# EAGLE design Piano DIY Project Yay (EAGLE 9.2.2)
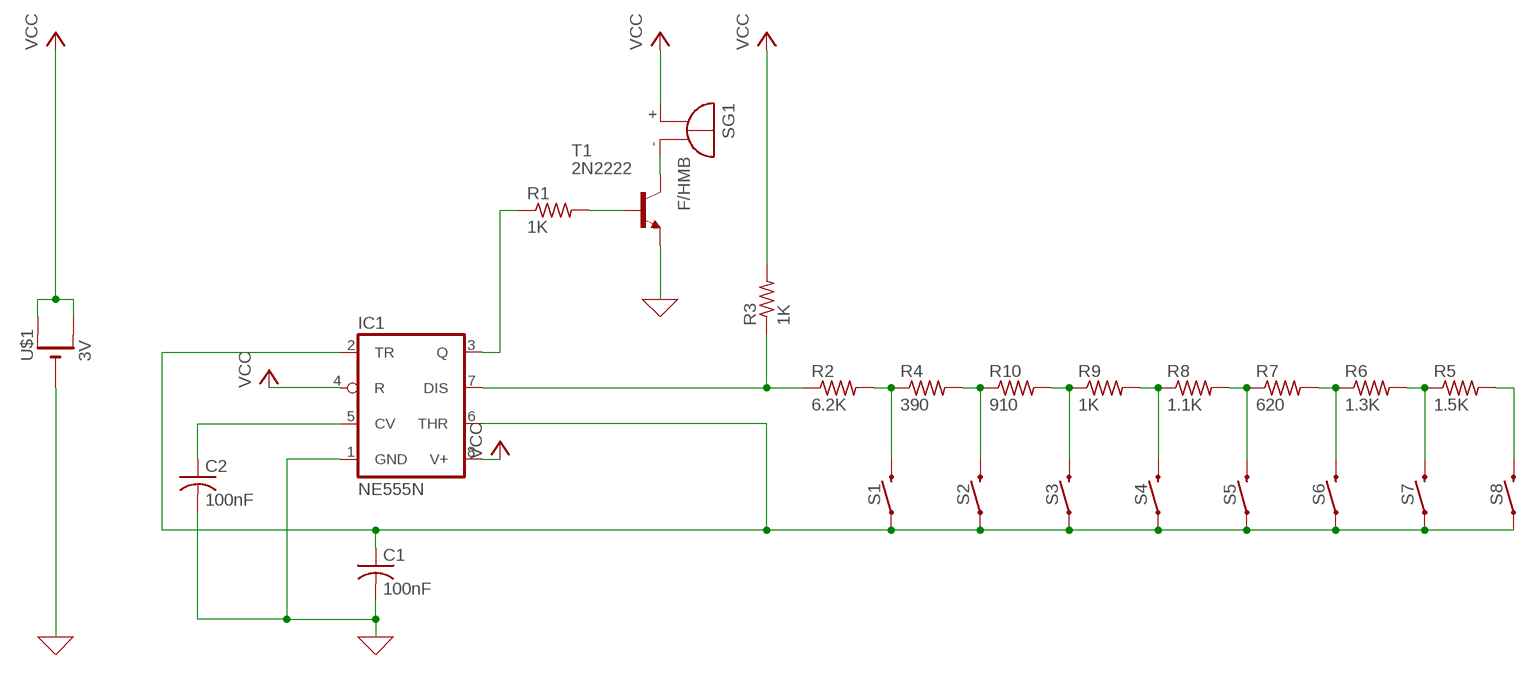
[diagram p0: schematic, sheet 1]

## Parts
C1  100nF  C-US025-025X050  [C025-025X050]
C2  100nF  C-US025-025X050  [C025-025X050]
IC1  NE555N  [DIL08]
R1  1K  R-US_0207/10  [0207/10]
R2  6.2K  R-US_0207/10  [0207/10]
R3  1K  R-US_0207/10  [0207/10]
R4  390  R-US_0207/10  [0207/10]
R5  1.5K  R-US_0207/10  [0207/10]
R6  1.3K  R-US_0207/10  [0207/10]
R7  620  R-US_0207/10  [0207/10]
R8  1.1K  R-US_0207/10  [0207/10]
R9  1K  R-US_0207/10  [0207/10]
R10  910  R-US_0207/10  [0207/10]
S1  MOMENTARY-SWITCH-SPST-PTH-6.0MM  [TACTILE_SWITCH_PTH_6.0MM]
S2  MOMENTARY-SWITCH-SPST-PTH-6.0MM  [TACTILE_SWITCH_PTH_6.0MM]
S3  MOMENTARY-SWITCH-SPST-PTH-6.0MM  [TACTILE_SWITCH_PTH_6.0MM]
S4  MOMENTARY-SWITCH-SPST-PTH-6.0MM  [TACTILE_SWITCH_PTH_6.0MM]
S5  MOMENTARY-SWITCH-SPST-PTH-6.0MM  [TACTILE_SWITCH_PTH_6.0MM]
S6  MOMENTARY-SWITCH-SPST-PTH-6.0MM  [TACTILE_SWITCH_PTH_6.0MM]
S7  MOMENTARY-SWITCH-SPST-PTH-6.0MM  [TACTILE_SWITCH_PTH_6.0MM]
S8  MOMENTARY-SWITCH-SPST-PTH-6.0MM  [TACTILE_SWITCH_PTH_6.0MM]
SG1  F/HMB  [F/HMB]
T1  2N2222  -NPN-TO92  [TO92]
U$1  3V  CR1220THM  [CR1220-THM]

## Nets
0: C1.2 C2.2 IC1.1(GND) T1.1(E) U$1.- ; supply symbol labelled GND
N$1: IC1.3(Q) R1.1
N$2: R1.2 T1.2(B)
N$3: SG1.- T1.3(C)
N$4: IC1.7(DIS) R2.1 R3.1
N$5: R2.2 R4.1 S1.3
N$6: R4.2 R10.1 S2.3
N$7: R9.1 R10.2 S3.3
N$8: R8.1 R9.2 S4.3
N$9: R7.1 R8.2 S5.3
N$10: R6.1 R7.2 S6.3
N$11: R5.1 R6.2 S7.3
N$12: R5.2 S8.3
N$13: C1.1 IC1.2(TR) IC1.6(THR) S1.1 S2.1 S3.1 S4.1 S5.1 S6.1 S7.1 S8.1
N$14: C2.1 IC1.5(CV)
VCC: IC1.4(R) IC1.8(V+) R3.2 SG1.+ U$1.+1(+) U$1.+2(+1)

## Library data of the parts
C1 C2 = rcl:C-US: CAPACITOR, American symbol; SPICEPREFIX: C
IC1 = linear:*555: TIMER
R1-R10 = rcl:R-US_: RESISTOR, American symbol; SPICEPREFIX: R
S1-S8 = SparkFun-Switches:MOMENTARY-SWITCH-SPST: Momentary Switch (Pushbutton) - SPST Normally-open (NO) SPST momentary switches (buttons, pushbuttons). Variants PTH-12MM - 12mm square, through-hole Momentary Pushbutton Switch - 12mm Square <https://www.sparkfun.com/products/9190> (COM-09190) PTH-6.0MM, PTH-6.0MM-KIT - 6.0mm square, through-hole Mini Pushbutton Switch <https://www.sparkfun.com/products/97> (COM-00097) KIT package intended for soldering kit's - only one side of pads' copper is exposed. PTH-RIGHT-ANGLE-KIT - Right-angle, through-hole Right Angle Tactile Button <https://www.sparkfun.com/products/10791> - Used on SparkFun BigTime Watch Kit <https://www.sparkfun.com/products/11734> SMD-12MM - 12mm square, surface-mount Tactile Button - SMD (12mm) <https://www.sparkfun.com/products/12993> (COM-12993) Used on SparkFun PicoBoard <https://www.sparkfun.com/products/11888> SMD-4.5MM - 4.5mm Square Trackball Switch Used on SparkFun Blackberry Trackballer Breakout <https://www.sparkfun.com/products/13169> SMD-4.6MMX2.8MM - 4.60mm x 2.80mm, surface mount Used on SparkFun SAMD21 Mini Breakout <https://www.sparkfun.com/products/13664> SMD-5.2MM, SMD-5.2-REDUNDANT - 5.2mm square, surface-mount Mini Pushbutton Switch - SMD <https://www.sparkfun.com/products/8720> (COM-08720) Used on Arduino Pro Mini <https://www.sparkfun.com/products/11114> REDUNDANT package connects both switch circuits together SMD-6.0X3.5MM - 6.0 x 3.5mm, surface mount Momentary Reset Switch SMD <https://www.sparkfun.com/products/8229> (COM-08229) SMD-6.2MM-TALL - 6.2mm square, surface mount Tactile Button - SMD (6mm) <https://www.sparkfun.com/products/12992> Used on SparkFun Digital Sandbox <https://www.sparkfun.com/products/12651> SMD-RIGHT-ANGLE - Right-angle, surface mount Used on SparkFun Block for Intel® Edison - Arduino <https://www.sparkfun.com/products/13036>; PROD_ID: SWCH-08441; SF_SKU: COM-00097
SG1 = buzzer:F/HMB: BUZZER Source: Buerklin; OC_FARNELL: unknown; OC_NEWARK: unknown
T1 = transistor:*-NPN-: NPN Transistror BF959 corrected 2008.03.06
U$1 = adafruit:CR1220: CR1216/CR1220/CR1225 12mm 3V lithium coin cell Great for battery packup. Both SMT and THM holders. Note the THM package has the ground pads on both sides of the PCB so that the masks are the same - this reduces the cost

## Net classes
0 default: width 0.305 mm, drill 0.508 mm, clearance 0.254 mm

## Board
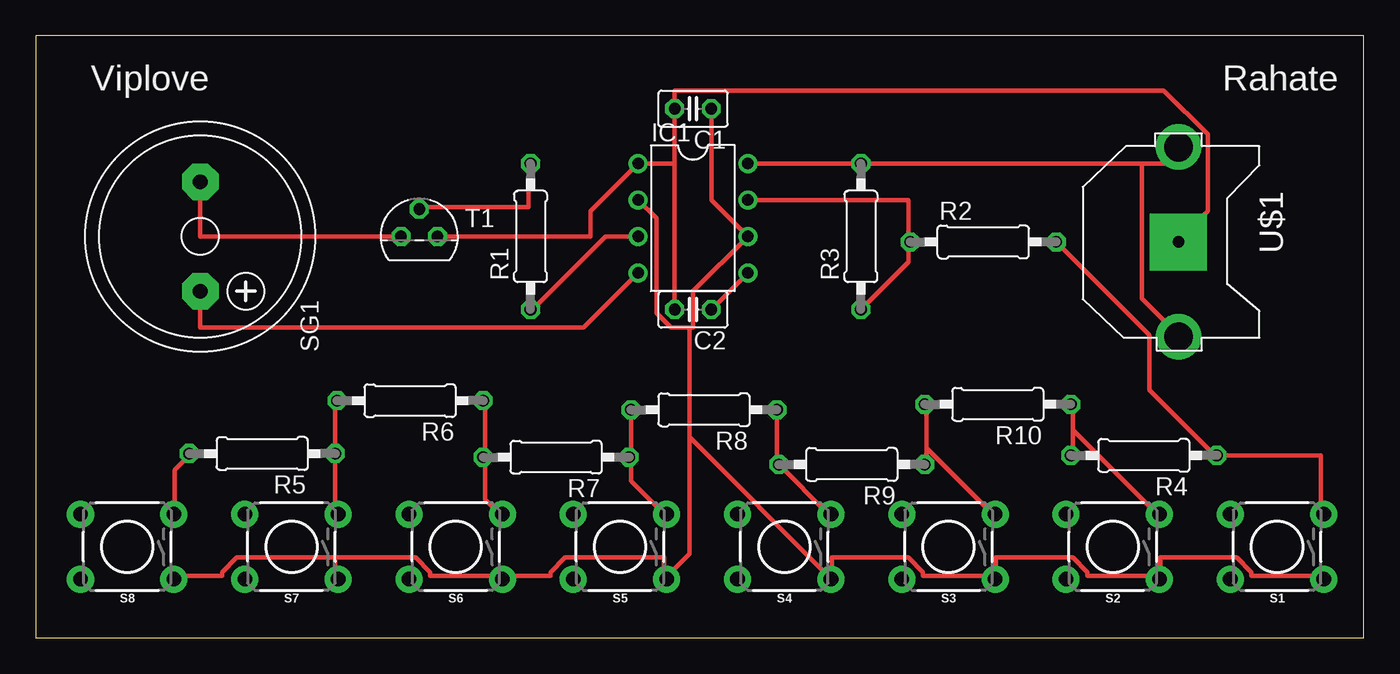
[diagram p1: board, top side]
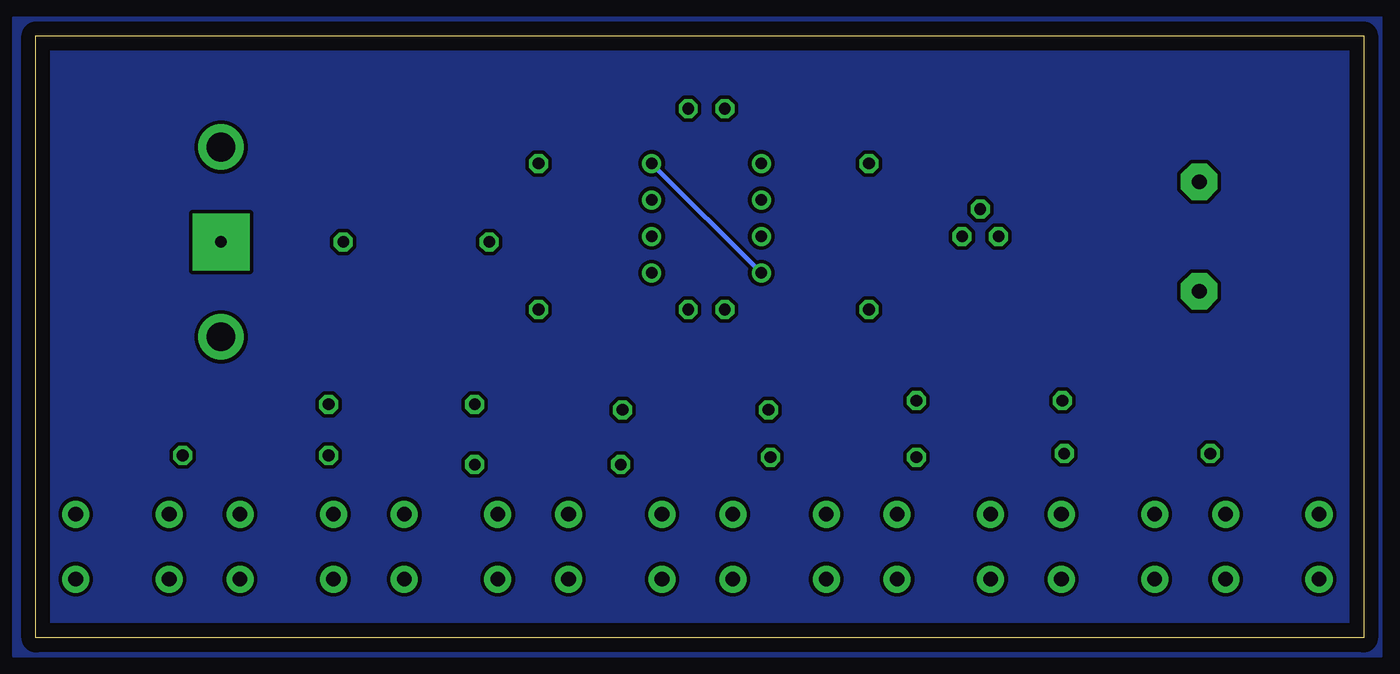
[diagram p2: board, bottom side, seen from below]

Size 92.38 x 41.9 mm. Coordinates in mm from the lower left corner, seen from the top.
Outline: 0,0 92.38,0 92.38,41.9 0,41.9 0,0
Copper layers (1*16): Top 0.035mm / dielectric 1.5mm / Bottom 0.035mm
Design rules "default": minimum track width 6mil, minimum drill 0.35mm, track to track 6mil, track to pad 6mil, pad to pad 6mil, via to via 6mil, smd to smd 6mil, copper to edge 40mil, drill to drill 6mil, minimum pad ring 10mil, minimum via ring 8mil, stop-mask expansion 4mil, vias tented up to drill 0mil, thermal gap 10mil

### Footprints (pad centres in the part's own frame; a part is rotated, then mirrored left to right if it is on the bottom)
C025-025X050 = drill 0.813 octagon: 1 -1.27,0; 2 1.27,0
DIL08 = drill 0.813 pad 1.27: 1 -3.81,-3.81; 2 -1.27,-3.81; 3 1.27,-3.81; 4 3.81,-3.81; 5 3.81,3.81; 6 1.27,3.81; 7 -1.27,3.81; 8 -3.81,3.81
0207/10 = drill 0.813 octagon: 1 -5.08,0; 2 5.08,0
TACTILE_SWITCH_PTH_6.0MM = drill 1.016 pad 1.88: 1 -3.251,2.261; 2 3.251,2.261; 3 -3.251,-2.261; 4 3.251,-2.261
F/HMB = drill 1.016 pad 2.54 octagon: + 3.81,0; - -3.81,0
TO92 = drill 0.813 octagon: 1 1.27,0; 2 0,1.905; 3 -1.27,0
CR1220-THM = drill 2 pad 3.175: +1 -6.604,0; +2 6.604,0 | drill 0.8 pad 3.962 square: - 0,0

### Placement (x,y rotation side)
C1  45.72,36.83 180 top
C2  45.72,22.86 180 top
IC1  45.72,29.21 270 top
R1  34.42,27.94 90 top
R2  65.91,27.56 0 top
R3  57.4,27.94 90 top
R4  77.09,12.7 180 top
R5  15.75,12.83 180 top
R6  26.04,16.51 180 top
R7  36.2,12.57 180 top
R8  46.48,15.88 180 top
R9  56.77,12.06 180 top
R10  66.93,16.26 180 top
S1  86.36,6.35 180 top
S2  74.93,6.35 180 top
S3  63.5,6.35 180 top
S4  52.07,6.35 180 top
S5  40.64,6.35 180 top
S6  29.21,6.35 180 top
S7  17.78,6.35 180 top
S8  6.35,6.35 180 top
SG1  11.43,27.94 270 top
T1  26.67,27.94 0 top
U$1  79.5,27.56 270 top

### Tracks (layer width: path | path; a pad name or v marks a point on that pad's centre or on a via)
0
  Top 0.305: 44.45,33.02 C1.2 44.45,38.1 78.49,38.1 81.53,35.05 81.53,29.72 79.5,27.69 U$1.- | 44.45,33.02 C2.2 | T1.1 38.61,27.94 38.61,29.72 IC1.1 44.45,33.02
GND
  pour Bottom: -1.27,43.18 93.98,43.18 93.98,-1.27 -1.27,-1.27
N$1
  Top 0.305: IC1.3 39.62,27.94 34.54,22.86 R1.1
N$2
  Top 0.305: T1.2 26.67,29.97 34.29,29.97 34.29,33.02 R1.2
N$3
  Top 0.305: T1.3 11.43,27.94 SG1.-
N$4
  Top 0.305: R3.1 60.71,26.16 60.71,27.43 R2.1 60.71,27.69 60.71,30.48 IC1.7
N$5
  Top 0.305: S1.3 89.41,8.64 89.41,12.7 R4.1 82.04,12.7 77.47,17.27 77.47,21.08 R2.2
N$6
  Top 0.305: 72.14,14.48 72.14,16.26 R10.1 | 72.14,14.48 72.14,12.7 R4.2 | 72.14,14.48 77.98,8.64 S2.3
N$7
  Top 0.305: 61.98,13.21 61.98,16.26 R10.2 | 61.98,13.21 61.98,12.19 R9.1 | 61.98,13.21 66.55,8.64 S3.3
N$8
  Top 0.305: R8.1 51.56,12.19 R9.2 55.12,8.64 S4.3
N$9
  Top 0.305: R8.2 41.4,12.7 R7.1 41.4,12.45 41.4,10.92 43.69,8.64 S5.3
N$10
  Top 0.305: R6.1 31.24,16.51 31.24,12.7 R7.2 31.24,12.45 31.24,9.65 32.26,8.64 S6.3
N$11
  Top 0.305: R6.2 20.83,16.51 R5.1 20.83,8.64 S7.3
N$12
  Top 0.305: R5.2 10.67,12.7 9.65,11.68 9.65,8.64 S8.3
N$13
  Top 0.305: 20.83,5.59 13.97,5.59 12.95,4.57 12.95,4.32 9.65,4.32 S8.1 | 20.83,5.59 20.83,4.32 S7.1 | 20.83,5.59 26.42,5.59 27.43,4.57 27.43,4.32 32.26,4.32 S6.1 32.51,4.32 35.81,4.32 35.81,4.57 36.83,5.59 43.69,5.59 43.69,4.32 S5.1 43.94,4.32 45.47,5.84 45.47,13.97 | C1.1 46.99,30.48 IC1.6 45.72,24.13 45.72,21.59 45.47,21.59 | IC1.2 43.18,29.21 43.18,22.61 44.2,21.59 45.47,21.59 | 45.47,21.59 45.47,13.97 | 45.47,13.97 55.12,4.32 S4.1 55.37,4.32 55.37,5.59 60.71,5.59 61.72,4.57 61.72,4.32 66.55,4.32 S3.1 66.8,4.32 66.8,5.59 72.14,5.59 73.15,4.57 73.15,4.32 77.98,4.32 S2.1 78.23,4.32 78.23,5.59 83.57,5.59 84.58,4.57 84.58,4.32 89.41,4.32 S1.1
N$14
  Top 0.305: IC1.5 C2.1
VCC
  Top 0.305: IC1.4 38.1,21.59 11.43,21.59 SG1.+ | IC1.8 R3.2 76.96,33.02 | 76.96,33.02 79.5,33.02 U$1.+1 | 76.96,33.02 76.96,23.62 79.5,21.08 U$1.+2
  Bottom 0.305: IC1.8 IC1.4

### Text on the board
tPlace: Viplove | Rahate